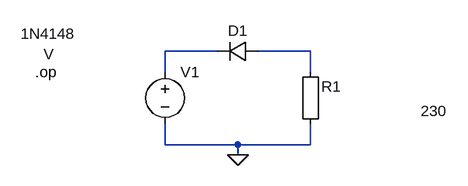
[diagram p0: schematic OP-R1.asc]
OP-R1.asc, the LTspice schematic file:
Version 4
SHEET 1 880 680
WIRE 16 208 -64 208
WIRE 160 208 80 208
WIRE -64 240 -64 208
WIRE 160 240 160 208
WIRE -64 352 -64 320
WIRE 48 352 -64 352
WIRE 160 352 160 320
WIRE 160 352 48 352
WIRE 48 368 48 352
FLAG 48 368 0
SYMBOL diode 80 192 R90
WINDOW 0 0 32 VBottom 2
WINDOW 3 -27 324 VTop 2
SYMATTR InstName D1
SYMATTR Value 1N4148
SYMBOL Misc\\EuropeanResistor 144 224 R0
WINDOW 0 33 38 Left 2
WINDOW 3 186 76 Left 2
SYMATTR InstName R1
SYMATTR Value 230
SYMBOL voltage -64 224 R0
WINDOW 3 -187 -12 Left 2
SYMATTR InstName V1
TEXT -264 240 Left 2 !.op

The netlist it stands for:
* OP-R1.asc
D1 N002 N001 1N4148
R1 N002 0 230
V1 N001 0 V
.model D D
.lib standard.dio
.op
.backanno
.end